# Altium schematic sheet LLS.SchDoc: LLS
size OrCAD A; ApprovedBy: Abbas Mahmoud; CheckedBy: Abbas Mahmoud; Author: Abbas Mahmoud; CompanyName: lsa 4wya :); DrawnBy: Abbas Mahmoud; Engineer: Abbas Mahmoud; DocumentNumber: 8; Revision: 1; SheetNumber: 8; SheetTotal: 8
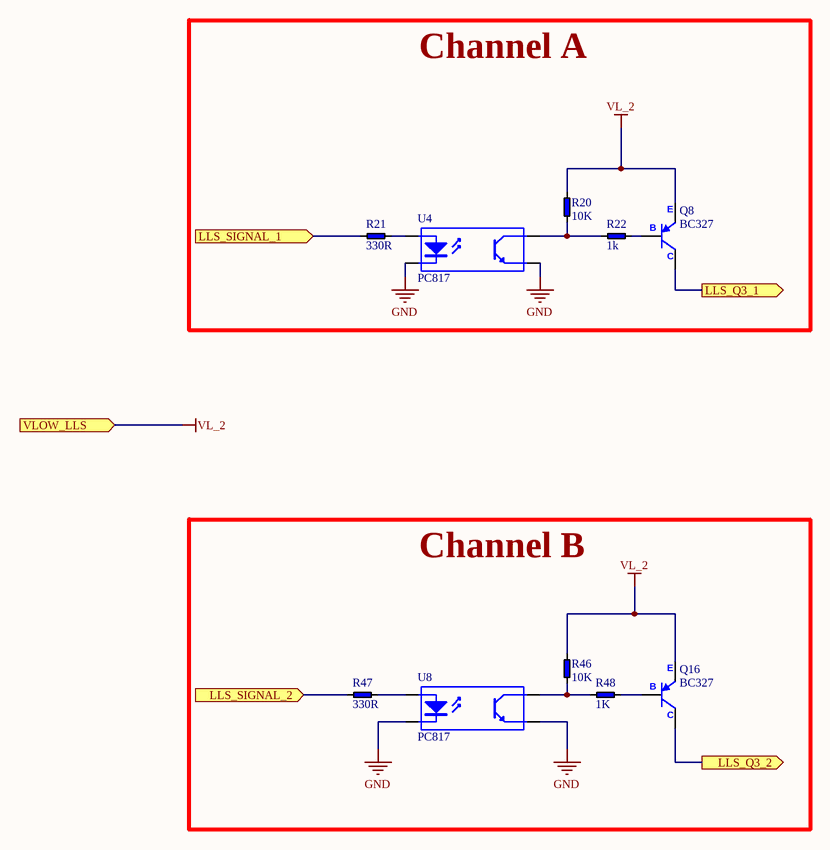
[diagram p0: LLS.SchDoc]

## Parts
Q8  BC327  [Transistor - duplicate3]
Q16  BC327  [Transistor - duplicate3]
R20  10K  [RESISTOR _9]
R21  330R  [RESISTOR _9]
R22  1k  [RESISTOR _9]
R46  10K  [RESISTOR _9]
R47  330R  [RESISTOR _9]
R48  1K  [RESISTOR _9]
U4  PC817  [IC X4 PIN]
U8  PC817  [IC X4 PIN]

## Blocks framed on the sheet
Channel A: Q8 R20-R22 U4
Channel B: Q16 R46-R48 U8

## Ports
LLS_Q3_1 (out), LLS_Q3_2 (out), LLS_SIGNAL_1 (in), LLS_SIGNAL_2 (in), VLOW_LLS (in)

## Nets
GND: U4.2(K) U4.3(E) U8.2(K) U8.3(E)
VL_2: Q8.1(E) Q16.1(E) R20.2 R46.2 ; port VLOW_LLS
LLS_Q3_1: Q8.3(C) ; port LLS_Q3_1
LLS_Q3_2: Q16.3(C) ; port LLS_Q3_2
LLS_SIGNAL_1: R21.1 ; port LLS_SIGNAL_1
LLS_SIGNAL_2: R47.1 ; port LLS_SIGNAL_2
NetQ8_2: Q8.2(B) R22.2
NetQ16_2: Q16.2(B) R48.2
NetR20_1: R20.1 R22.1 U4.4(C)
NetR21_2: R21.2 U4.1(A)
NetR46_1: R46.1 R48.1 U8.4(C)
NetR47_2: R47.2 U8.1(A)

## Notes on the sheet
- Title
- Size:
- Date:
- Orcad A
- Number:
- Time:
- Revision:
- Sheet
- of
- File:

## Library data of the parts
Q8 Q16 = PNP
R20-R22 R46-R48 = RESISTOR
U4 U8 = Opto-coupler: 4-Pin Phototransistor Optocoupler; Published: 24-Mar-1999; LatestRevisionDate: 04-Mar-2005; LatestRevisionNote: Sch pins 3 & 4 Swapped.; DatasheetVersion: Nov-2003; PackageReference: DIP-4; Publisher: Altium Limited